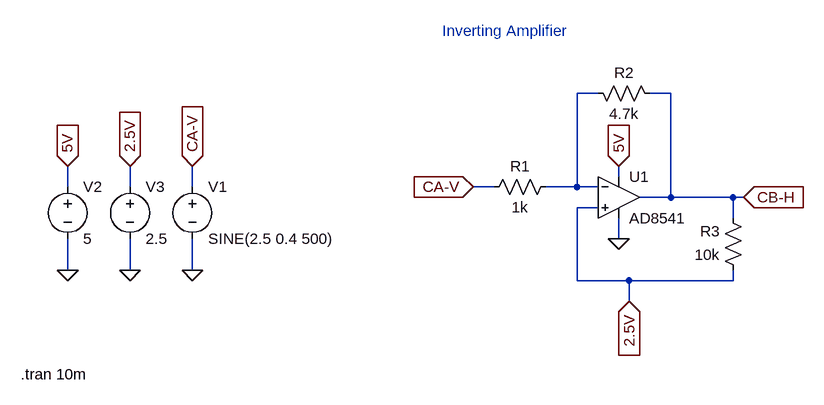
[diagram p0: schematic inverting_amplifier.asc]
inverting_amplifier.asc, the LTspice schematic file:
Version 4
SHEET 1 880 680
WIRE 512 -32 480 -32
WIRE 624 -32 592 -32
WIRE 544 96 544 80
WIRE -304 112 -304 80
WIRE -208 112 -208 80
WIRE -112 112 -112 80
WIRE 352 112 320 112
WIRE 480 112 480 -32
WIRE 480 112 432 112
WIRE 512 112 480 112
WIRE 624 128 624 -32
WIRE 624 128 576 128
WIRE 720 128 624 128
WIRE 736 128 720 128
WIRE 512 144 480 144
WIRE 720 160 720 128
WIRE 544 192 544 160
WIRE -304 240 -304 192
WIRE -208 240 -208 192
WIRE -112 240 -112 192
WIRE 480 256 480 144
WIRE 560 256 480 256
WIRE 720 256 720 240
WIRE 720 256 560 256
WIRE 560 288 560 256
FLAG -112 240 0
FLAG -304 240 0
FLAG -112 80 CA-V
IOPIN -112 80 In
FLAG 320 112 CA-V
IOPIN 320 112 In
FLAG -304 80 5V
IOPIN -304 80 In
FLAG 560 288 2.5V
IOPIN 560 288 In
FLAG 544 192 0
FLAG -208 240 0
FLAG -208 80 2.5V
IOPIN -208 80 In
FLAG 544 80 5V
IOPIN 544 80 In
FLAG 736 128 CB-H
IOPIN 736 128 In
SYMBOL Opamps\\AD8541 544 64 R0
SYMATTR InstName U1
SYMBOL res 736 256 R180
WINDOW 0 36 76 Left 2
WINDOW 3 36 40 Left 2
SYMATTR InstName R3
SYMATTR Value 10k
SYMBOL res 448 96 R90
WINDOW 0 0 56 VBottom 2
WINDOW 3 32 56 VTop 2
SYMATTR InstName R1
SYMATTR Value 1k
SYMBOL voltage -112 96 R0
WINDOW 123 0 0 Left 0
WINDOW 39 0 0 Left 0
SYMATTR InstName V1
SYMATTR Value SINE(2.5 0.4 500)
SYMBOL voltage -304 96 R0
WINDOW 123 0 0 Left 0
WINDOW 39 0 0 Left 0
SYMATTR InstName V2
SYMATTR Value 5
SYMBOL voltage -208 96 R0
WINDOW 123 0 0 Left 0
WINDOW 39 0 0 Left 0
SYMATTR InstName V3
SYMATTR Value 2.5
SYMBOL res 496 -48 M90
WINDOW 0 0 56 VBottom 2
WINDOW 3 32 56 VTop 2
SYMATTR InstName R2
SYMATTR Value 4.7k
TEXT 272 -128 Left 2 ;Inverting Amplifier
TEXT -376 400 Left 2 !.tran 10m

The netlist it stands for:
* inverting_amplifier.asc
XU1 2.5V N001 5V 0 CB-H AD8541  ; pins In+ In- V+ V- OUT
R3 2.5V CB-H 10k
R1 N001 CA-V 1k
V1 CA-V 0 SINE(2.5 0.4 500)
V2 5V 0 5
V3 2.5V 0 2.5
R2 N001 CB-H 4.7k
* Inverting Amplifier
.tran 10m
.backanno
.end